# EasyEDA Pro project PCB3.epro

# Board PCB3
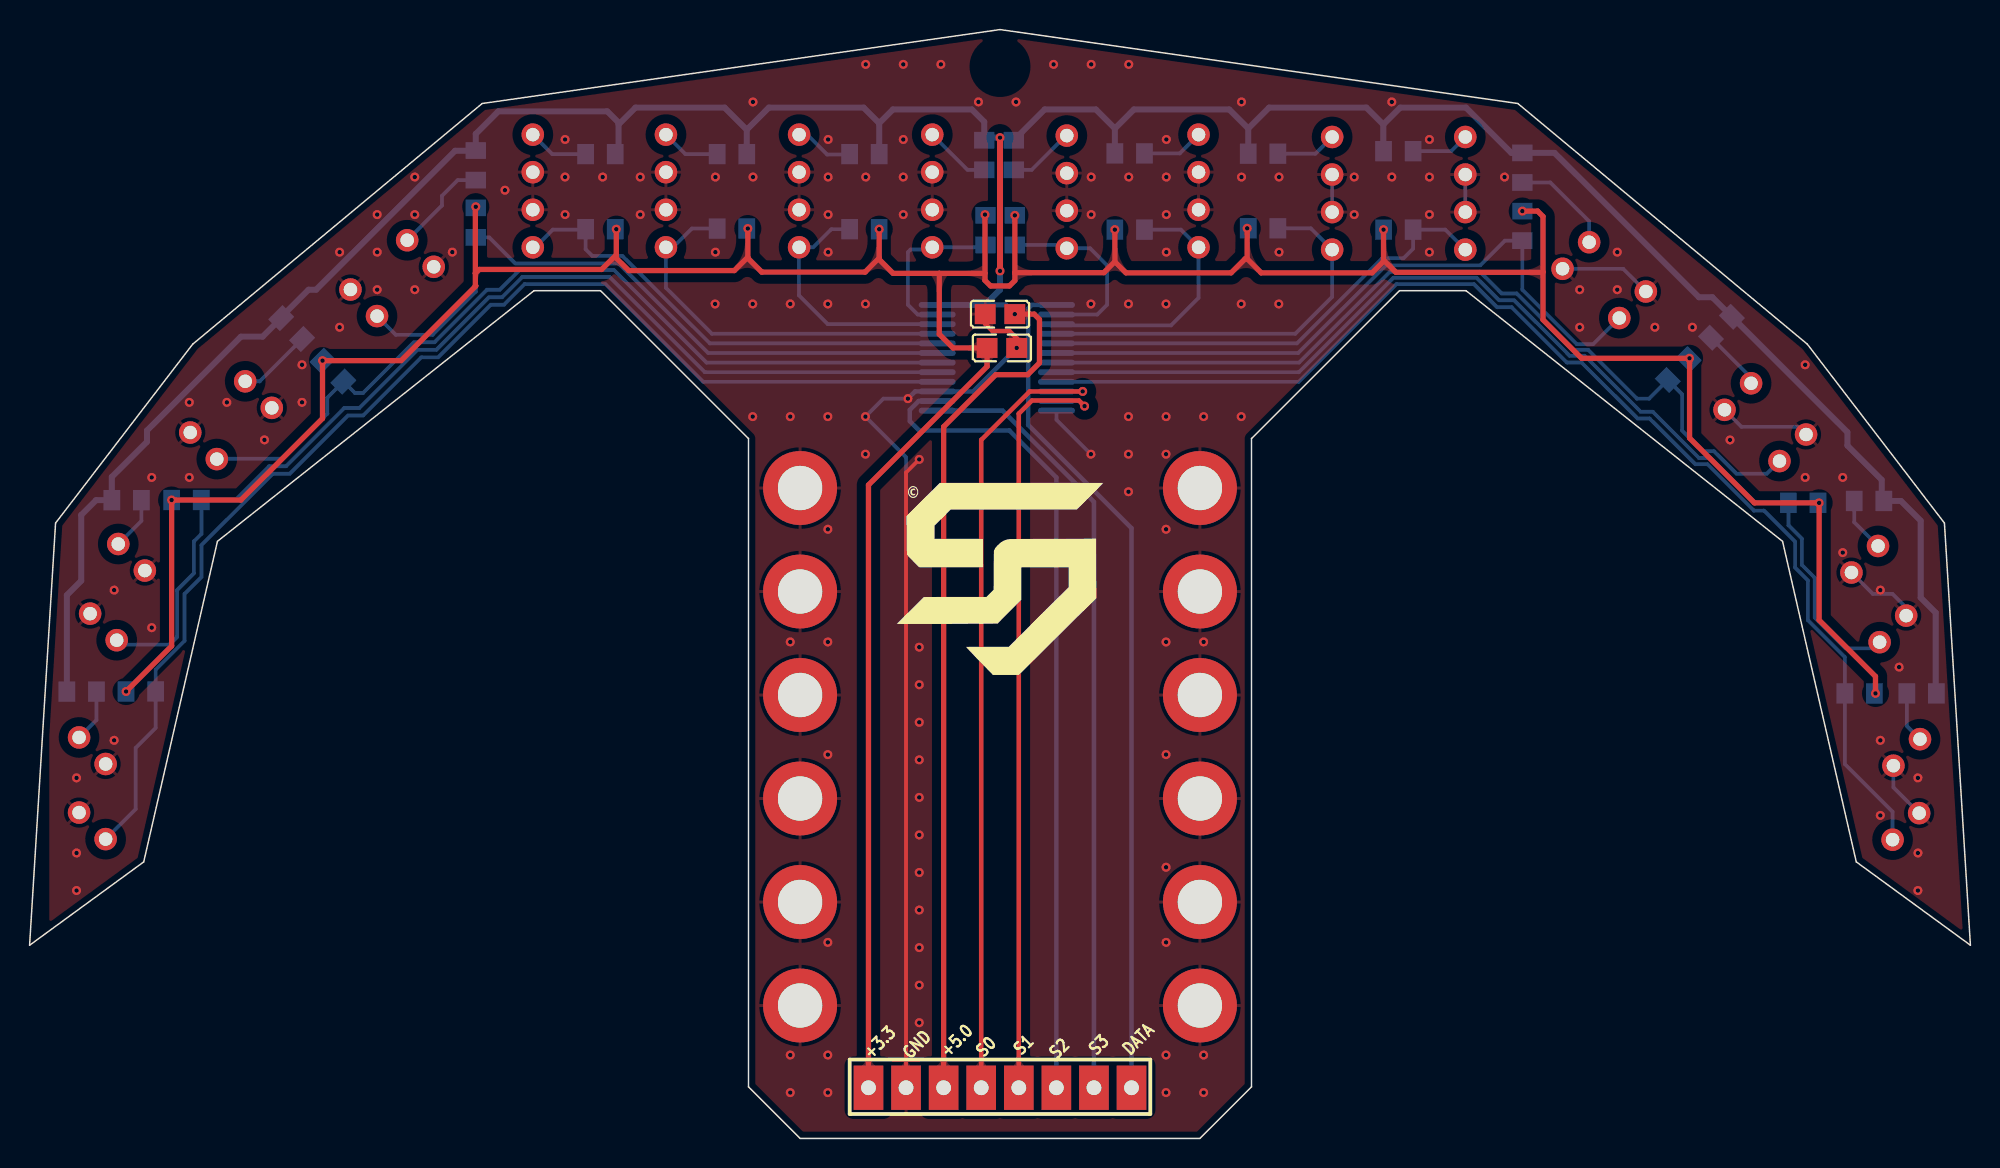
[diagram p0: board, top side]
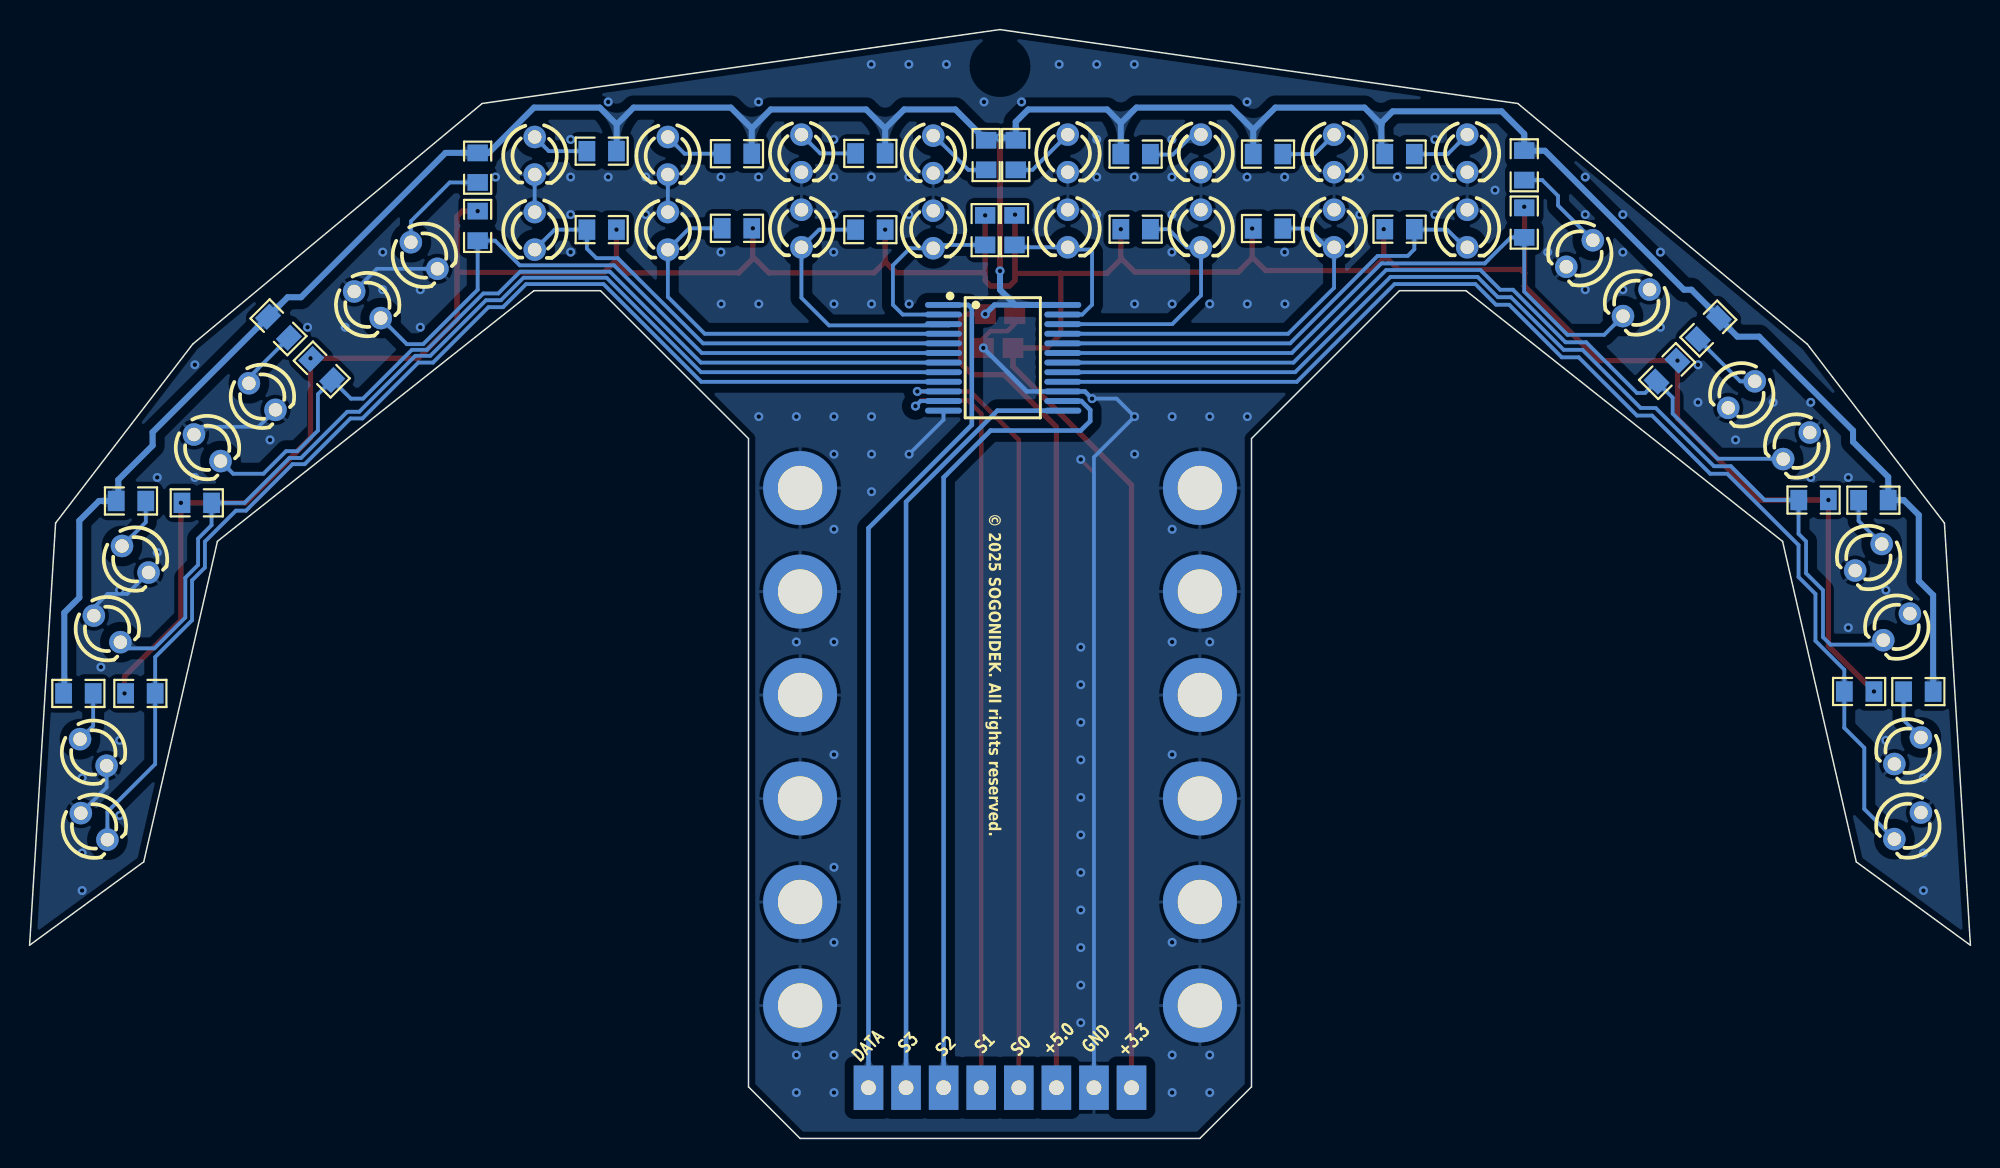
[diagram p1: board, bottom side, seen from below]

Outline 131.18 x 75 mm; copper layers: Top Layer, Bottom Layer. Coordinates in mm from the lower left corner of the outline.
Outline path: 0,13.07 7.71,18.7 12.7,40.39 34.09,57.34 38.59,57.34 48.59,47.34 48.59,3.49 52.08,0 79.1,0 82.59,3.49 82.59,47.34 92.59,57.34 97.09,57.34 118.49,40.39 123.47,18.7 131.18,13.07 129.43,41.62 120.16,53.72 100.59,70 65.59,75 30.59,70 11.02,53.72 1.76,41.62 0,13.07
Stack: Top Layer 0.035mm / Dielectric1 1.51mm FR4 er 4.5 / Bottom Layer 0.035mm

## Design rules (mm)
template: Custom Config
spacing copperThickness1oz (default): track to track 0.102, other pairs 0.152 to 0.3
spacing copperThickness2oz: track to track 0.203, other pairs 0.152 to 0.3
track width copperThickness1oz (default): min 0.127, default 0.254, max 2.54
track width copperThickness2oz: min 0.203, default 0.254, max 2.54
differential pair differentialPair (default): width min 0.127, default 0.254, max 2.54; gap min 0.152, default 0.152
via viaSize (default): diameter min 0.5, default 0.61, max 10; hole min 0.3, default 0.305, max 6.299
pour e1804 uses copperRegion

## Placement (name value [footprint] x y rotation side)
C14  100nF  [C0805]  65.59 55.75 180 top
C15  100nF  [C0805]  65.72 53.47 0 top
H8  -  [HDR-TH_8P-P2.54-V-M]  65.59 3.43 0 top
LED1  -  [LED-TH_BD3.0-P2.54-FD]  70.11 66.56 270 bottom
LED2  -  [LED-TH_BD3.0-P2.54-FD]  124.04 39.17 225 bottom
LED3  -  [LED-TH_BD3.0-P2.54-FD]  115.46 50.18 225 bottom
LED4  -  [LED-TH_BD3.0-P2.54-FD]  104.51 59.72 225 bottom
LED5  -  [LED-TH_BD3.0-P2.54-FD]  97.04 66.46 270 bottom
LED6  -  [LED-TH_BD3.0-P2.54-FD]  88.04 66.46 270 bottom
LED7  -  [LED-TH_BD3.0-P2.54-FD]  79.01 66.62 270 bottom
LED8  -  [LED-TH_BD3.0-P2.54-FD]  126.88 26.11 225 bottom
LED9  -  [LED-TH_BD3.0-P2.54-FD]  61.01 66.62 270 bottom
LED10  -  [LED-TH_BD3.0-P2.54-FD]  52.01 66.62 270 bottom
LED11  -  [LED-TH_BD3.0-P2.54-FD]  43.01 66.62 270 bottom
LED12  -  [LED-TH_BD3.0-P2.54-FD]  34.01 66.62 270 bottom
LED13  -  [LED-TH_BD3.0-P2.54-FD]  26.42 59.85 315 bottom
LED14  -  [LED-TH_BD3.0-P2.54-FD]  15.47 50.31 315 bottom
LED15  L  [LED-TH_BD3.0-P2.54-FD]  6.89 39.31 315 bottom
LED16  L  [LED-TH_BD3.0-P2.54-FD]  4.24 26.22 315 bottom
PHOTO1  -  [LED-TH_BD3.0-P2.54-FD]  70.11 61.48 270 bottom
PHOTO2  -  [LED-TH_BD3.0-P2.54-FD]  125.94 34.46 225 bottom
PHOTO3  -  [LED-TH_BD3.0-P2.54-FD]  119.18 46.71 225 bottom
PHOTO4  -  [LED-TH_BD3.0-P2.54-FD]  108.35 56.39 225 bottom
PHOTO5  -  [LED-TH_BD3.0-P2.54-FD]  97.04 61.38 270 bottom
PHOTO6  -  [LED-TH_BD3.0-P2.54-FD]  88.04 61.38 270 bottom
PHOTO7  -  [LED-TH_BD3.0-P2.54-FD]  79.01 61.54 270 bottom
PHOTO8  -  [LED-TH_BD3.0-P2.54-FD]  126.82 21.1 225 bottom
PHOTO9  -  [LED-TH_BD3.0-P2.54-FD]  61.01 61.54 270 bottom
PHOTO10  -  [LED-TH_BD3.0-P2.54-FD]  52.01 61.54 270 bottom
PHOTO11  -  [LED-TH_BD3.0-P2.54-FD]  43.01 61.54 270 bottom
PHOTO12  -  [LED-TH_BD3.0-P2.54-FD]  34.01 61.54 270 bottom
PHOTO13  -  [LED-TH_BD3.0-P2.54-FD]  22.58 56.52 315 bottom
PHOTO14  -  [LED-TH_BD3.0-P2.54-FD]  11.76 46.85 315 bottom
PHOTO15  P  [LED-TH_BD3.0-P2.54-FD]  4.99 34.6 315 bottom
PHOTO16  P  [LED-TH_BD3.0-P2.54-FD]  4.24 21.14 315 bottom
R32  330  [R0805]  66.53 66.51 270 bottom
R33  4K7  [R0805]  66.59 61.43 270 bottom
R34  330  [R0805]  124.33 43.12 180 bottom
R35  4K7  [R0805]  119.88 42.99 180 bottom
R36  330  [R0805]  114.36 54.86 225 bottom
R37  4K7  [R0805]  111.44 52.01 225 bottom
R38  330  [R0805]  100.9 65.66 270 bottom
R39  4K7  [R0805]  100.9 61.72 270 bottom
R40  330  [R0805]  92.52 66.78 0 bottom
R41  4K7  [R0805]  92.52 61.47 0 bottom
R42  330  [R0805]  83.37 66.6 0 bottom
R43  4K7  [R0805]  83.37 61.56 0 bottom
R44  330  [R0805]  74.35 66.62 0 bottom
R45  4K7  [R0805]  74.35 61.47 0 bottom
R46  330  [R0805]  127.88 30.1 180 bottom
R47  4K7  [R0805]  123.69 30.1 180 bottom
R48  330  [R0805]  3.52 30.22 0 bottom
R49  4K7  [R0805]  7.52 30.23 0 bottom
R50  330  [R0805]  6.56 43.17 0 bottom
R51  4K7  [R0805]  10.6 43.18 0 bottom
R52  330  [R0805]  17.71 54.78 315 bottom
R53  4K7  [R0805]  20.51 51.9 315 bottom
R54  330  [R0805]  30.16 65.82 270 bottom
R55  4K7  [R0805]  30.16 61.94 270 bottom
R56  330  [R0805]  38.58 66.58 180 bottom
R57  4K7  [R0805]  38.58 61.5 180 bottom
R58  330  [R0805]  47.47 66.58 180 bottom
R59  4K7  [R0805]  47.47 61.54 180 bottom
R60  330  [R0805]  56.43 66.58 180 bottom
R61  4K7  [R0805]  56.43 61.5 180 bottom
R62  330  [R0805]  64.53 66.51 270 bottom
R63  4K7  [R0805]  64.61 61.43 270 bottom
U2  HC4067  [SSOP-24_L8.2-W5.3-P0.65-LS7.8-BL]  65.4 52.8 270 bottom
U4  -  [HOLE ARRAY 3MM]  52.08 43.99 0 top
U5  -  [HOLE ARRAY 3MM]  79.1 43.99 0 top
U6  -  [HOLE ARRAY 3MM]  79.1 36.99 0 top
U7  -  [HOLE ARRAY 3MM]  79.1 29.99 0 top
U8  -  [HOLE ARRAY 3MM]  52.08 15.99 0 top
U9  -  [HOLE ARRAY 3MM]  52.08 29.99 0 top
U10  -  [HOLE ARRAY 3MM]  52.08 22.99 0 top
U11  -  [HOLE ARRAY 3MM]  52.08 36.99 0 top
U12  -  [HOLE ARRAY 3MM]  79.1 22.99 0 top
U13  -  [HOLE ARRAY 3MM]  52.08 8.99 0 top
U14  -  [HOLE ARRAY 3MM]  79.1 8.99 0 top
U15  -  [HOLE ARRAY 3MM]  79.1 15.99 0 top

## Footprints (pads in the part's own frame, mm; a bottom-side part is the same pattern mirrored in y, then rotated)
C0805
  rect 1.41x1.35 smd: 1(-1,0) 2(1,0)
HDR-TH_8P-P2.54-V-M
  rect 2x3 hole 1: 1(-8.89,0) 2(-6.35,0) 3(-3.81,0) 4(-1.27,0) 5(1.27,0) 6(3.81,0) 7(6.35,0) 8(8.89,0)
HOLE ARRAY 3MM
  round 5 hole 3: 1(0,0)
LED-TH_BD3.0-P2.54-FD
  round 1.524 hole 0.914: 1(-1.27,0) 2(1.27,0)
R0805
  rect 1.133x1.377 smd: 1(-1,0) 2(1,0)
SSOP-24_L8.2-W5.3-P0.65-LS7.8-BL
  oval 0.4x2.5 smd: 1(-3.575,-4.006) 2(-2.925,-4.006) 3(-2.275,-4.006) 4(-1.625,-4.006) 5(-0.975,-4.006) 6(-0.325,-4.006) 7(0.325,-4.006) 8(0.975,-4.006) 9(1.625,-4.006) 10(2.275,-4.006) 11(2.925,-4.006) 12(3.575,-4.006) 13(3.575,4.058) 14(2.925,4.058) 15(2.275,4.058) 16(1.625,4.058) 17(0.975,4.058) 18(0.325,4.058) 19(-0.325,4.058) 20(-0.975,4.058) 21(-1.625,4.058) 22(-2.275,4.058) 23(-2.925,4.058) 24(-3.575,4.058)

## Nets
+3.3V: C15.1 H8.1 R33.1 R35.1 R37.1 R39.1 R41.1 R43.1 R45.1 R47.1 R49.1 R51.1 R53.1 R55.1 R57.1 R59.1 R61.1 R63.1
+5V: C14.1 H8.3 R32.1 R34.1 R36.1 R38.1 R40.1 R42.1 R44.1 R46.1 R48.1 R50.1 R52.1 R54.1 R56.1 R58.1 R60.1 R62.1 U2.24
GND: C14.2 C15.2 H8.2 LED1.2 LED2.2 LED3.2 LED4.2 LED5.2 LED6.2 LED7.2 LED8.2 LED9.2 LED10.2 LED11.2 LED12.2 LED13.2 LED14.2 LED15.2 LED16.2 PHOTO1.1 PHOTO2.1 PHOTO3.1 PHOTO4.1 PHOTO5.1 PHOTO6.1 PHOTO7.1 PHOTO8.1 PHOTO9.1 PHOTO10.1 PHOTO11.1 PHOTO12.1 PHOTO13.1 PHOTO14.1 PHOTO15.1 PHOTO16.1 U2.12 U2.15 U4.1 U5.1 U6.1 U7.1 U8.1 U9.1 U10.1 U11.1 U12.1 U13.1 U14.1 U15.1
0: PHOTO8.2 R47.2 U2.9
1: PHOTO2.2 R35.2 U2.8
2: PHOTO3.2 R37.2 U2.7
3: PHOTO4.2 R39.2 U2.6
4: PHOTO5.2 R41.2 U2.5
5: PHOTO6.2 R43.2 U2.4
6: PHOTO7.2 R45.2 U2.3
7: PHOTO1.2 R33.2 U2.2
8: PHOTO9.2 R63.2 U2.23
9: PHOTO10.2 R61.2 U2.22
10: PHOTO11.2 R59.2 U2.21
11: PHOTO12.2 R57.2 U2.20
12: PHOTO13.2 R55.2 U2.19
13: PHOTO14.2 R53.2 U2.18
14: PHOTO15.2 R51.2 U2.17
15: PHOTO16.2 R49.2 U2.16
SIGNAL: H8.8 U2.1
SL0: H8.4 U2.10
SL1: H8.5 U2.11
SL2: H8.6 U2.14
SL3: H8.7 U2.13
$1N3099: LED1.1 R32.2
$1N4303: LED2.1 R34.2
$1N4307: LED3.1 R36.2
$1N4312: LED4.1 R38.2
$1N4317: LED5.1 R40.2
$1N4322: LED6.1 R42.2
$1N4327: LED7.1 R44.2
$1N4332: LED8.1 R46.2
$1N4337: LED16.1 R48.2
$1N4342: LED15.1 R50.2
$1N4347: LED14.1 R52.2
$1N4352: LED13.1 R54.2
$1N4357: LED12.1 R56.2
$1N4362: LED11.1 R58.2
$1N4367: LED10.1 R60.2
$1N4372: LED9.1 R62.2

## Via types
v1: diameter 0.61, hole 0.305, Top Layer to Bottom Layer, 164 vias

## Routing (per net, layer and track width the routed paths; a pad name or vN(x,y) marks a point on that pad's centre or on a via; arc(x,y) is an arc through that point)
+3.3V: length 257.8
  Top Layer w0.355: 39.66,59.76 38.67,58.78 30.39,58.78 30.13,58.52 ; 39.66,59.76 39.66,59.54 40.5,58.7 47.63,58.7 48.55,59.61 ; 39.66,59.76 v1(39.66,61.5) ; 64.58,58.51 64.58,58.04 64.96,57.66 66.23,57.66 66.59,58.03 66.59,58.56 ; 64.58,58.51 v1(64.58,62.48) ; 64.58,58.51 61.48,58.51 ; 66.59,58.56 72.61,58.56 73.35,59.3 ; 66.59,58.56 v1(66.59,62.43) ; 48.55,59.61 48.55,59.54 49.49,58.6 56.47,58.6 57.43,59.55 ; 48.55,59.61 v1(48.55,61.54) ; v1(57.43,61.5) 57.43,59.55 ; 57.43,59.55 57.43,59.45 58.36,58.51 61.48,58.51 ; v1(6.52,30.23) 9.6,33.31 v1(9.6,43.18) 14.28,43.18 19.8,48.7 v1(19.8,52.61) 25.11,52.61 30.16,57.66 30.13,57.69 30.13,58.52 ; 61.48,58.51 61.48,54.4 62.42,53.47 C15.1 64.72,52.21 56.7,44.2 H8.1 ; v1(91.52,61.47) 91.52,59.42 ; 91.52,59.42 91.52,59.33 90.74,58.55 83.24,58.55 82.3,59.49 ; 91.52,59.42 92.36,58.58 102.26,58.58 102.29,58.61 ; 82.3,59.49 82.16,59.49 81.21,58.55 74.11,58.55 73.35,59.3 ; 82.3,59.49 v1(82.3,61.56) ; 73.35,59.3 v1(73.35,61.47) ; v1(124.77,30.1) 124.77,31.25 120.96,35.06 v1(120.96,42.99) 116.58,42.99 112.2,47.37 112.2,52.76 v1(112.2,52.77) 104.9,52.77 102.29,55.37 102.29,58.61 ; v1(100.9,62.72) 101.93,62.72 102.29,62.36 102.29,58.61 ; 30.13,58.52 30.13,62.99 v1(30.16,63.02)
  Bottom Layer w0.355: v1(64.58,62.48) 64.61,62.45 R63.1
+5V: length 269.3
  Top Layer w0.355: v1(66.59,55.75) 67.9,55.75 68.26,55.4 68.26,52.45 67.46,51.66 65.31,51.66 61.78,48.13 H8.3
  Top Layer w0.406: v1(65.59,67.69) v1(65.59,58.67)
  Bottom Layer w0.355: v1(66.59,55.75) 65.97,56.38 64.56,56.38
  Bottom Layer w0.406: 73.35,68.31 72.07,69.6 68.61,69.6 R32.1 66.35,67.69 v1(65.59,67.69) 64.7,67.69 R62.1 64.53,68.76 63.69,69.6 58.35,69.6 57.43,68.67 ; 73.35,68.31 74.64,69.6 81.09,69.6 82.37,68.31 ; 73.35,68.31 R44.1 ; R56.1 39.81,66.8 39.81,68.58 ; 57.43,68.67 R60.1 ; 57.43,68.67 56.37,69.72 49.97,69.72 48.47,68.23 ; 39.81,68.58 40.95,69.72 46.98,69.72 48.47,68.23 ; 39.81,68.58 39.81,68.71 39.05,69.47 31.68,69.47 30.16,67.94 R54.1 30.14,66.8 28.76,66.8 19.36,57.4 18.86,57.4 17.01,55.55 R52.1 15.75,54.23 14.28,54.23 7.93,47.88 7.93,47.12 5.56,44.74 R50.1 4.5,43.17 3.49,42.16 3.49,37.72 2.52,36.75 R48.1 ; 82.37,68.31 R42.1 ; 82.37,68.31 83.78,69.72 90.36,69.72 91.5,68.58 ; 61.84,56.38 64.56,56.38 65.59,57.4 v1(65.59,58.67) ; 91.5,68.58 92.64,69.72 97.09,69.72 100.15,66.66 R38.1 103.07,66.66 112.84,56.9 113.74,56.9 R36.1 122.87,47.77 122.87,46.86 125.19,44.54 125.19,43.26 R34.1 126.49,43.12 127.82,41.78 127.82,36.58 128.84,35.56 128.84,30.15 R46.1 ; 91.5,68.58 91.5,66.79 R40.1 ; 48.47,68.23 R58.1
GND: length 136
  Top Layer w0.254: H8.2 59.24,45.04 v1(60.13,45.93)
  Top Layer w0.305: v1(66.72,53.47) 66.72,54.12 66.23,54.61 65.08,54.61 64.59,55.1 C14.2
  Bottom Layer w0.254: v1(59.37,50.04) 57.71,50.04 v1(56.5,48.82) 59.24,46.08 H8.2 ; PHOTO4.1 107.71,58.82 LED4.2 ; LED6.2 PHOTO6.1 ; v1(71.74,46.28) 69.41,48.61 69.41,49.22 ; 114.56,49.28 115.71,48.13 119.55,48.13 PHOTO3.1 ; LED2.2 124.59,36.83 125.92,36.83 126.84,35.91 126.84,35.36 ; 125.98,25.21 125.98,23.74 PHOTO8.1 ; LED5.2 PHOTO5.1
  Bottom Layer w0.305: v1(59.37,50.04) 59.86,50.53 63.78,50.53 v1(66.72,53.47)
  vias: v1(3.17,24.39) v1(3.17,19.31) v1(3.17,16.77) v1(5.71,37.09) v1(5.71,26.93) v1(8.25,44.71) v1(8.25,34.55) v1(10.79,49.79) v1(10.79,44.71) v1(13.33,49.79) v1(15.87,47.25) v1(18.41,52.33) v1(18.41,49.79) v1(20.95,59.95) v1(20.95,54.87) v1(23.49,62.49) v1(23.49,59.95) v1(23.49,57.41) v1(26.03,65.03) v1(26.03,62.49) v1(26.03,57.41) v1(28.57,59.95) v1(32.13,64.14) v1(36.19,67.57) v1(36.19,65.03) v1(36.19,62.49) v1(38.73,65.03) v1(41.27,65.03) v1(41.27,62.49) v1(46.34,56.44) v1(46.35,65.03) v1(46.35,59.95) v1(48.89,70.11) v1(48.89,65.03) v1(48.88,56.44) v1(48.88,48.82) v1(51.42,56.44) v1(51.42,48.82) v1(51.42,33.58) v1(51.42,5.64) v1(51.42,3.1) v1(53.97,67.57) v1(53.97,65.03) v1(53.97,62.49) v1(53.97,59.95) v1(53.96,56.44) v1(53.96,48.82) v1(53.96,41.2) v1(53.96,33.58) v1(53.96,25.96) v1(53.96,13.26) v1(53.96,5.64) v1(53.96,3.1) v1(56.51,72.65) v1(56.51,65.03) v1(56.5,56.44) v1(56.5,46.28) v1(59.05,72.65) v1(59.05,67.57) v1(59.05,65.03) v1(59.05,62.49) v1(60.13,33.23) v1(60.13,30.69) v1(60.13,28.15) v1(60.13,25.61) v1(60.13,23.07) v1(60.13,20.53) v1(60.13,17.99) v1(60.13,15.45) v1(60.13,12.91) v1(60.13,10.37) v1(60.13,7.83) v1(61.59,72.65) v1(64.13,70.11) v1(66.67,70.11) v1(69.21,72.65) v1(71.74,56.44) v1(71.75,72.65) v1(71.75,65.03) v1(71.75,62.49) v1(74.29,72.65) v1(74.29,65.03) v1(74.28,56.44) v1(74.28,48.82) v1(74.28,46.28) v1(74.28,43.74) v1(76.83,67.57) v1(76.83,65.03) v1(76.83,62.49) v1(76.83,59.95) v1(76.82,56.44) v1(76.82,48.82) v1(76.82,46.28) v1(76.82,41.2) v1(76.82,33.58) v1(76.82,25.96) v1(76.82,18.34) v1(76.82,13.26) v1(76.82,5.64) v1(76.82,3.1) v1(79.36,48.82) v1(79.36,33.58) v1(79.36,5.64) v1(79.36,3.1) v1(81.91,70.11) v1(81.91,65.03) v1(81.9,56.44) v1(81.9,48.82) v1(84.44,56.44) v1(84.45,65.03) v1(84.45,59.95) v1(89.53,65.03) v1(89.53,62.49) v1(92.07,70.11) v1(92.07,65.03) v1(94.61,67.57) v1(94.61,65.03) v1(94.61,62.49) v1(94.61,59.95) v1(99.69,65.03) v1(104.77,57.41) v1(104.77,54.87) v1(107.31,59.95) v1(107.31,57.41) v1(109.85,54.87) v1(112.39,54.87) v1(114.93,47.25) v1(120.01,52.33) v1(120.01,44.71) v1(122.55,44.71) v1(122.55,39.63) v1(125.09,37.09) v1(125.09,26.93) v1(125.09,21.85) v1(126.36,31.88) v1(127.63,24.39) v1(127.63,19.31) v1(127.63,16.77)
0: length 83.2
  Bottom Layer w0.254: 125.92,20.21 125.92,22.09 122.69,25.32 R47.2 122.69,32.56 120.2,35.05 120.2,37.74 119.33,38.61 119.33,40.37 117.24,42.46 116.55,42.46 113.41,45.6 112.59,45.6 109.5,48.69 108.69,48.69 104.9,52.48 103.91,52.48 100.17,56.22 99.19,56.22 97.62,57.78 92.39,57.78 85.78,51.17 68.97,51.17
1: length 72.8
  Bottom Layer w0.254: PHOTO2.2 124.63,33.15 122.74,33.15 120.66,35.23 120.66,37.92 119.79,38.79 119.79,40.56 118.88,41.47 R35.2 116.66,42.99 113.62,46.03 112.84,46.03 109.71,49.15 108.9,49.15 105.11,52.93 104.1,52.93 100.34,56.69 99.32,56.69 97.8,58.22 92.19,58.22 85.79,51.83 68.97,51.83
2: length 60.4
  Bottom Layer w0.254: PHOTO3.2 117.42,44.96 115.38,44.96 113.85,46.48 113.09,46.48 111.69,47.88 111.69,50.33 R37.2 109.47,50.04 108.64,50.04 105.34,53.34 104.33,53.34 100.52,57.15 99.5,57.15 98.03,58.62 91.96,58.62 85.81,52.47 68.97,52.47
3: length 47.2
  Bottom Layer w0.254: 68.97,53.12 85.75,53.12 91.68,59.06 98.05,59.06 99.72,60.72 R39.2 100.9,57.4 104.58,53.72 105.68,53.72 PHOTO4.2
4: length 32.6
  Bottom Layer w0.254: 68.97,53.78 85.66,53.78 91.42,59.54 92.87,59.54 93.52,60.18 R41.2 95.69,61.47 PHOTO5.2
5: length 27.6
  Bottom Layer w0.254: R43.2 86.6,61.56 PHOTO6.2 88.04,56.92 85.55,54.43 68.97,54.43
6: length 18.4
  Bottom Layer w0.254: R45.2 77.82,61.47 PHOTO7.2 79.01,56.85 77.15,54.99 69.05,54.99 68.97,55.08
7: length 13.6
  Bottom Layer w0.254: 68.97,55.73 72.17,55.73 72.83,56.39 72.83,59.06 71.68,60.21 PHOTO1.2 69.88,60.43 R33.2
8: length 11.7
  Bottom Layer w0.254: 61.84,55.73 60.03,55.73 59.37,56.39 59.37,59.94 59.55,60.12 60.86,60.12 PHOTO9.2 64.45,60.27 R63.2
9: length 17.8
  Bottom Layer w0.254: R61.2 54.19,61.5 52.97,60.27 PHOTO10.2 52,60.26 52,57.02 53.95,55.08 61.84,55.08
10: length 26.8
  Bottom Layer w0.254: 61.84,54.43 46.12,54.43 43.01,57.53 PHOTO11.2 43.49,60.27 44.76,61.54 R59.2
11: length 32.3
  Bottom Layer w0.254: PHOTO12.2 34.17,60.27 35.37,61.47 37.55,61.47 R57.2 37.58,60.14 38.03,59.69 40.06,59.69 45.98,53.78 61.84,53.78
12: length 47
  Bottom Layer w0.254: PHOTO13.2 24.75,54.36 27.24,54.36 30.16,57.28 R55.2 31.06,60.94 32.83,59.18 39.81,59.18 45.87,53.12 61.84,53.12
13: length 58.4
  Bottom Layer w0.254: 61.84,52.47 45.76,52.47 39.49,58.74 33.12,58.74 31.78,57.4 30.92,57.4 27.36,53.85 25.97,53.85 22.54,50.42 21.99,50.42 R53.2 20.13,50.11 20.13,49.02 17.08,45.97 12.68,45.97 PHOTO14.2
14: length 73.5
  Bottom Layer w0.254: 61.84,51.83 45.64,51.83 39.2,58.27 33.31,58.27 31.94,56.9 31.05,56.9 27.49,53.34 26.22,53.34 22.28,49.4 21.27,49.4 17.33,45.47 16.19,45.47 13.9,43.18 R51.2 11.62,43.16 11.62,40.89 11.11,40.39 11.11,38.23 9.97,37.08 9.97,33.91 9.46,33.4 6.19,33.4 5.89,33.7
15: length 82.8
  Bottom Layer w0.254: PHOTO16.2 7.17,22.28 7.17,26.42 8.52,27.77 R49.2 8.52,31.7 10.47,33.66 10.47,36.83 11.62,37.97 11.62,40.13 16.44,44.96 17.59,44.96 21.52,48.89 22.54,48.89 26.48,52.83 27.62,52.83 31.17,56.39 32.06,56.39 33.46,57.78 38.92,57.78 45.53,51.17 61.84,51.17
SIGNAL: length 57.2
  Bottom Layer w0.305: 68.97,56.38 67.74,56.38 67.5,56.13 67.5,48.26 74.48,41.28 H8.8
SL0: length 54.2
  Top Layer w0.305: H8.4 64.32,47.24 67.6,50.53 v1(71.18,50.53)
  Bottom Layer w0.254: 68.97,50.53 v1(71.18,50.53)
SL1: length 53
  Top Layer w0.305: v1(71.31,49.53) 70.93,49.91 67.75,49.91 66.86,49.02 H8.5
  Bottom Layer w0.254: 68.97,49.88 70.96,49.88 v1(71.31,49.53)
SL2: length 56.1
  Bottom Layer w0.305: 61.84,49.88 60.09,49.88 59.5,49.28 59.5,48.51 60.13,47.88 66.23,47.88 69.4,44.7 H8.6
SL3: length 52.3
  Bottom Layer w0.305: 61.84,49.22 65.77,49.22 71.94,43.05 H8.7
$1N3099: length 4.5
  Bottom Layer w0.254: R32.2 67.73,65.51 70.05,67.83 LED1.1
$1N4303: length 3.7
  Bottom Layer w0.254: R34.2 123.33,41.68 LED2.1
$1N4307: length 4.2
  Bottom Layer w0.254: R36.2 116.36,51.45 LED3.1
$1N4312: length 7
  Bottom Layer w0.254: LED4.1 105.41,62.03 102.79,64.66 R38.2
$1N4317: length 3.9
  Bottom Layer w0.254: R40.2 96.08,66.78 LED5.1
$1N4322: length 4.1
  Bottom Layer w0.254: LED6.1 86.91,66.6 R42.2
$1N4327: length 4.2
  Bottom Layer w0.254: LED7.1 77.74,66.62 R44.2
$1N4332: length 3.5
  Bottom Layer w0.254: R46.2 126.88,27.9 LED8.1
$1N4337: length 3.6
  Bottom Layer w0.254: R48.2 4.52,28.3 LED16.1
$1N4342: length 3.6
  Bottom Layer w0.254: 5.99,40.2 7.56,41.77 R50.2
$1N4347: length 5
  Bottom Layer w0.254: LED14.1 15.56,51.21 R52.2
$1N4352: length 6.7
  Bottom Layer w0.254: LED13.1 27.87,63.1 27.87,63.75 28.94,64.82 R54.2
$1N4357: length 4.1
  Bottom Layer w0.254: R56.2 35.33,66.58 LED12.1
$1N4362: length 4
  Bottom Layer w0.254: LED11.1 44.33,66.58 R58.2
$1N4367: length 4
  Bottom Layer w0.254: R60.2 55.4,66.55 53.91,66.55 52.56,67.89 LED10.1
$1N4372: length 4.5
  Bottom Layer w0.254: LED9.1 63.39,65.51 R62.2

## Copper pours and planes (outline as drawn; the poured copper is in the pictures)
GND on Top Layer: 1.33,74.42 139.25,74.42 139.25,-5.08 1.33,-5.08
GND on Bottom Layer: -3.12,76.71 134.43,76.71 134.43,-4.06 -3.12,-4.06

Small or netless copper shapes (teardrops, artwork), in the pictures only: 46 on Top Layer, 159 on Bottom Layer

## Text on the board
Bottom Silkscreen Layer: +3.3 | GND | +5.0 | S0 | S1 | S2 | S3 | DATA | © 2025 SOGONIDEK. All rights reserved.
Top Silkscreen Layer: +3.3 | GND | +5.0 | S0 | S1 | S2 | S3 | DATA | ©
